# Altium project EE579_Skittles_PCB.PrjPcb
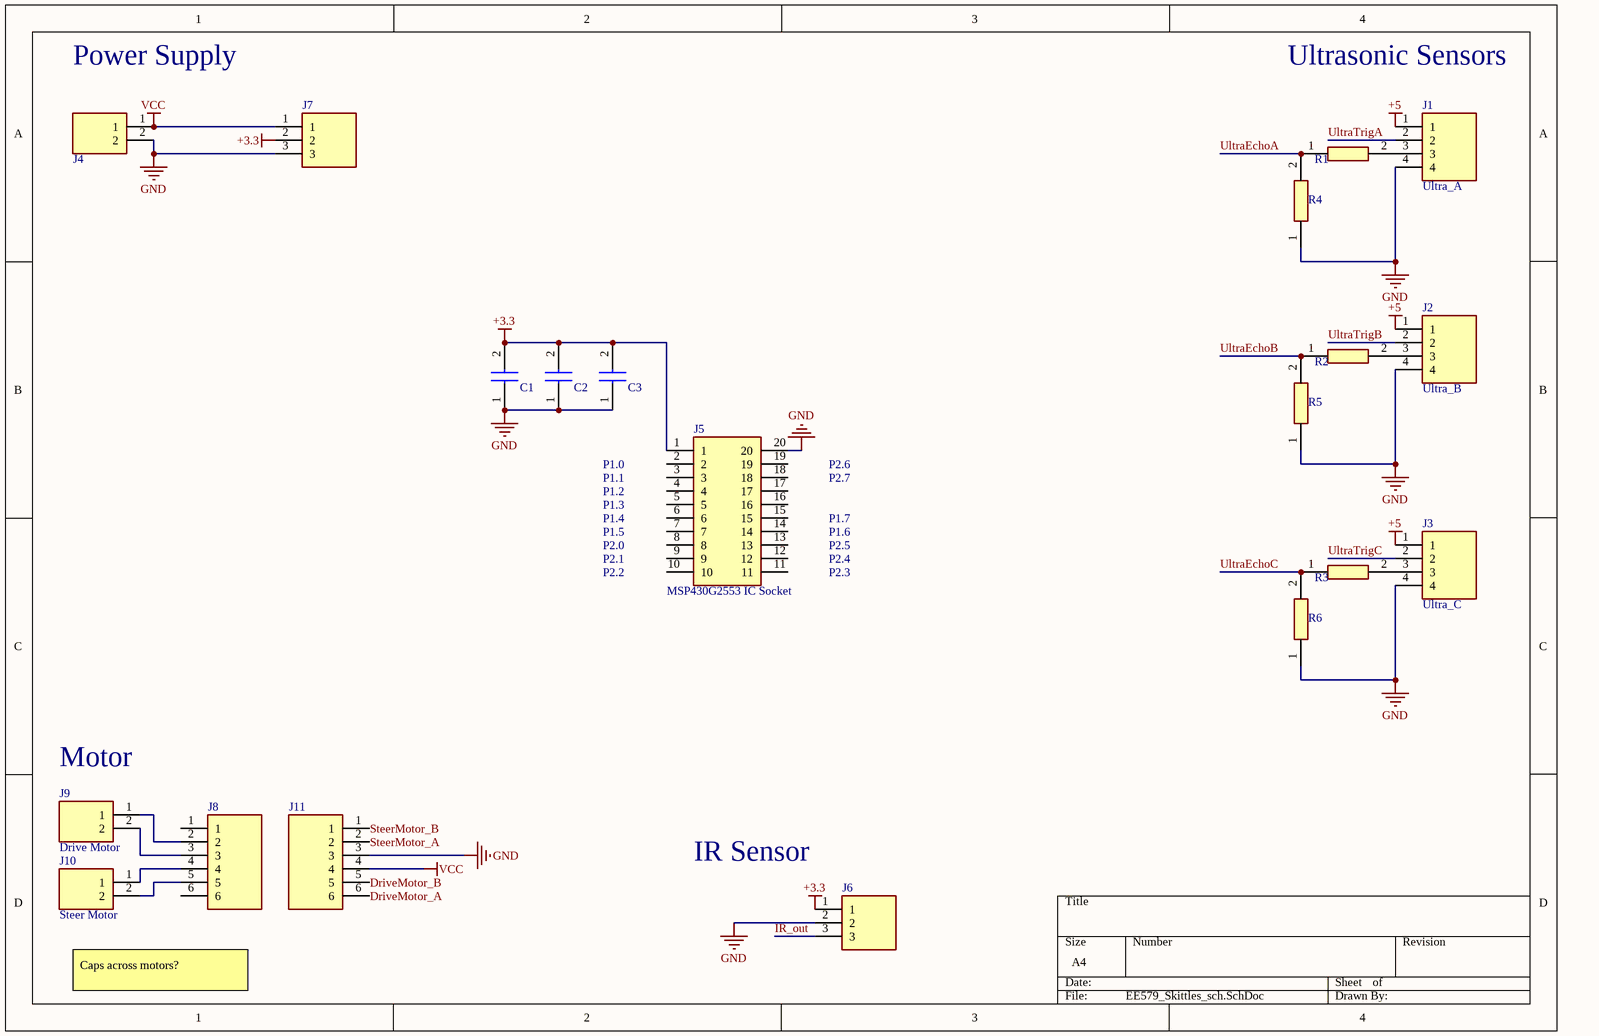
[diagram p0: EE579_Skittles_sch.SchDoc]
1 sheet, 20 parts. Net scope: global (net labels, ports and power ports of the same name join across sheets).
Board file: EE579_Skittles_pcb.PcbDoc

## Sheet EE579_Skittles_sch.SchDoc
size A4; SheetNumber: 1; SheetTotal: 1

### Parts
C1  21A106KQFNNNG  [CAPC2012X135N]  (value not drawn)
C2  CL21B105KPFNNNE  [CAPC2012X135N]  (value not drawn)
C3  CC0805KPX7R9BB104  [CAPC2012X95N]  (value not drawn)
J1  Ultra_A  [SHDR4W64P0X250_1X4_1240X575X700P]
J2  Ultra_B  [SHDR4W64P0X250_1X4_1240X575X700P]
J3  Ultra_C  [SHDR4W64P0X250_1X4_1240X575X700P]
J4  B2B-PH-K-S_LF__SN_  [SHDR2W50P0X200_1X2_590X450X600P]  (value not drawn)
J5  MSP430G2553 IC Socket  [DIPS762W70P254L2540H510Q20N]
J6  B3B-XH-A__LF__SN_  [SHDR3W64P0X250_1X3_990X575X700P]  (value not drawn)
J7  801-87-003-10-001101  [RHDR3W60P0X254_1X3_762X254X700P]  (value not drawn)
J8  61300611821  [RHDR6W97P0X254_1X6_1574X250X865P]  (value not drawn)
J9  Drive Motor  [SHDR2W50P0X200_1X2_590X450X600P]
J10  Steer Motor  [SHDR2W50P0X200_1X2_590X450X600P]
J11  61300611821  [RHDR6W97P0X254_1X6_1574X250X865P]  (value not drawn)
R1  ERJ-PB6B3002V  [RESC2012X70N]  (value not drawn)
R2  ERJ-PB6B3002V  [RESC2012X70N]  (value not drawn)
R3  ERJ-PB6B3002V  [RESC2012X70N]  (value not drawn)
R4  ERJ-PB6B3002V  [RESC2012X70N]  (value not drawn)
R5  ERJ-PB6B3002V  [RESC2012X70N]  (value not drawn)
R6  ERJ-PB6B3002V  [RESC2012X70N]  (value not drawn)

### Nets
+3.3: C1.2 C2.2 C3.2 J5.1 J6.1 J7.2
+5: J1.1 J2.1 J3.1
GND: C1.1 C2.1 C3.1 J1.4 J2.4 J3.4 J4.2 J5.20 J6.2 J7.3 J11.3 R4.1 R5.1 R6.1
VCC: J4.1 J7.1 J11.4
DriveMotor_A: J11.6
DriveMotor_B: J11.5
IR_out: J6.3
SteerMotor_A: J11.2
SteerMotor_B: J11.1
UltraEchoA: R1.1 R4.2
UltraEchoB: R2.1 R5.2
UltraEchoC: R3.1 R6.2
UltraTrigA: J1.2
UltraTrigB: J2.2
UltraTrigC: J3.2
NetJ1_3: J1.3 R1.2
NetJ2_3: J2.3 R2.2
NetJ3_3: J3.3 R3.2
NetJ8_2: J8.2 J9.1
NetJ8_3: J8.3 J9.2
NetJ8_4: J8.4 J10.1
NetJ8_5: J8.5 J10.2

Not connected (* = marked no-connect by the designer): J5 2 3 4 5 6 7 8 9 10 11 12 13 14 15 16 17 18 19; J8 1 6

### Notes on the sheet
- Power Supply
- Ultrasonic Sensors
- P1.0
- P1.1
- P1.2
- P1.3
- P1.4
- P1.7
- P2.6
- P2.7
- P1.5
- P2.0
- P2.1
- P2.2
- P2.3
- P2.4
- P2.5
- P1.6
- (near J9) Motor
- (near J6) IR Sensor
- Caps across motors?

### Library data of the parts
C1 = CL21A106KQFNNNG: Capacitor; Manufacturer_Name: SAMSUNG; Datasheet Link: https://octopart.com/cl21a106kpfnnne-samsung-9301557?gclid=EAIaIQobChMIppmoo53d5wIV14XVCh0LRA8uEAAYAiAAEgJJyPD_BwE; Height: 1.35mm; Manufacturer_Part_Number: CL21A106KQFNNNG; Mouser Part Number: 187-CL21A106KQFNNNG; Mouser Price/Stock: https://www.mouser.co.uk/ProductDetail/Samsung-Electro-Mechanics/CL21A106KQFNNNG?qs=hqM3L16%252Bxle4yU%252BqidqWig%3D%3D; Arrow Part Number: CL21A106KQFNNNG; Arrow Price/Stock: https://www.arrow.com/en/products/cl21a106kqfnnng/samsung-electro-mechanics?region=nac
C2 = CL21B105KPFNNNE: Capacitor; Manufacturer_Name: SAMSUNG; Datasheet Link: https://datasheet.datasheetarchive.com/originals/distributors/Datasheets_SAMA/2d87a2a5c85914a1c305fff6363ab8b8.pdf; Height: 1.35mm; Manufacturer_Part_Number: CL21B105KPFNNNE; Mouser Part Number: 187-CL21B105KPFNNNE; Mouser Price/Stock: https://www.mouser.co.uk/ProductDetail/Samsung-Electro-Mechanics/CL21B105KPFNNNE?qs=349EhDEZ59rb3V94UrmRdQ%3D%3D; Arrow Part Number: CL21B105KPFNNNE; Arrow Price/Stock: https://www.arrow.com/en/products/cl21b105kpfnnne/samsung-electro-mechanics?region=nac
C3 = CC0805KPX7R9BB104: Capacitor; Manufacturer_Name: YAGEO; Datasheet Link: https://www.yageo.com/upload/media/product/productsearch/datasheet/mlcc/UPY-GPHC_X7R_6.3V-to-250V_22.pdf; Height: 0.95mm; Manufacturer_Part_Number: CC0805KPX7R9BB104; Mouser Part Number: 603-CC805KPX7R9BB104; Mouser Price/Stock: https://www.mouser.co.uk/ProductDetail/YAGEO/CC0805KPX7R9BB104?qs=vTakOoo5QyLPWGiom%252Bf2Ug%3D%3D
J1-J3 = B4B-XH-A__LF__SN_: Connector; Manufacturer_Name: JST (JAPAN SOLDERLESS TERMINALS); Manufacturer_Part_Number: B4B-XH-A (LF)(SN); Datasheet Link: https://componentsearchengine.com/Datasheets/2/B4B-XH-A (LF)(SN).pdf; Height: 7mm; Arrow Part Number: B4B-XH-A (LF)(SN); Arrow Price/Stock: https://www.arrow.com/en/products/b4b-xh-a-lf-sn/jst-manufacturing?region=europe
J4 J9 J10 = B2B-PH-K-S_LF__SN_: Connector; Manufacturer_Name: JST (JAPAN SOLDERLESS TERMINALS); Manufacturer_Part_Number: B2B-PH-K-S(LF)(SN); Datasheet Link: https://datasheet.lcsc.com/szlcsc/JST-Sales-America-B2B-PH-K-S-LF-SN_C131337.pdf; Height: 6mm; Arrow Part Number: B2B-PH-K-S(LF)(SN); Arrow Price/Stock: https://www.arrow.com/en/products/b2b-ph-k-s-lf-sn/jst-manufacturing?region=europe
J5 = 1-2199298-6: Connector; Manufacturer_Name: TE Connectivity; Datasheet Link: https://www.te.com/commerce/DocumentDelivery/DDEController?Action=showdoc&DocId=Customer+Drawing%7F2199298%7FA%7Fpdf%7FEnglish%7FENG_CD_2199298_A_baseFilename.pdf%7F1-2199298-6; Height: 5.1mm; Manufacturer_Part_Number: 1-2199298-6; Mouser Part Number: 571-1-2199298-6; Mouser Price/Stock: https://www.mouser.co.uk/ProductDetail/TE-Connectivity/1-2199298-6?qs=fK8dlpkaUMvuMXpJTs4GlA%3D%3D; Arrow Part Number: 1-2199298-6; Arrow Price/Stock: https://www.arrow.com/en/products/1-2199298-6/te-connectivity?region=europe
J6 = B3B-XH-A__LF__SN_: Connector; Manufacturer_Name: JST (JAPAN SOLDERLESS TERMINALS); Manufacturer_Part_Number: B3B-XH-A (LF)(SN); Datasheet Link: http://www.jst-mfg.com/product/pdf/eng/eXH.pdf; Height: 7mm
J7 = 801-87-003-10-001101: Connector; Manufacturer_Name: Preci-Dip; Datasheet Link: http://www.precidip.com/en/Products/PCB-Connectors/pview/801-PP-NNN-10-001101.html; Height: 7mm; Manufacturer_Part_Number: 801-87-003-10-001101; Mouser Part Number: 437-8018700310001101; Mouser Price/Stock: https://www.mouser.co.uk/ProductDetail/Preci-dip/801-87-003-10-001101?qs=FtMuP6KVi2T66jAxB5rZkg%3D%3D; Arrow Part Number: 801-87-003-10-001101; Arrow Price/Stock: https://www.arrow.com/en/products/801-87-003-10-001101/preci-dip-sa
J8 J11 = 61300611821: Connector; Manufacturer_Name: Wurth Elektronik; Description: WURTH ELEKTRONIK - 61300611821 - PCB Receptacle; Datasheet Link: https://www.we-online.de/katalog/datasheet/61300611821.pdf; Height: 8.65mm; Manufacturer_Part_Number: 61300611821; Mouser Part Number: 710-61300611821; Mouser Price/Stock: https://www.mouser.co.uk/ProductDetail/Wurth-Elektronik/61300611821?qs=iLbezkQI%252BsgS21jF2eozhA%3D%3D
R1-R6 = ERJ-PB6B3002V: Resistor; Manufacturer_Name: Panasonic; Datasheet Link: https://componentsearchengine.com/Datasheets/1/ERJ-PB6B3002V.pdf; Height: 0.7mm; Manufacturer_Part_Number: ERJ-PB6B3002V; Mouser Part Number: 667-ERJ-PB6B3002V; Mouser Price/Stock: https://www.mouser.co.uk/ProductDetail/Panasonic/ERJ-PB6B3002V?qs=eFOtW6xYNWHxFAxx7HWdpg%3D%3D; Arrow Part Number: ERJ-PB6B3002V; Arrow Price/Stock: https://www.arrow.com/en/products/erj-pb6b3002v/panasonic?region=nac